# EAGLE design mainboard (EAGLE 6.5.0)
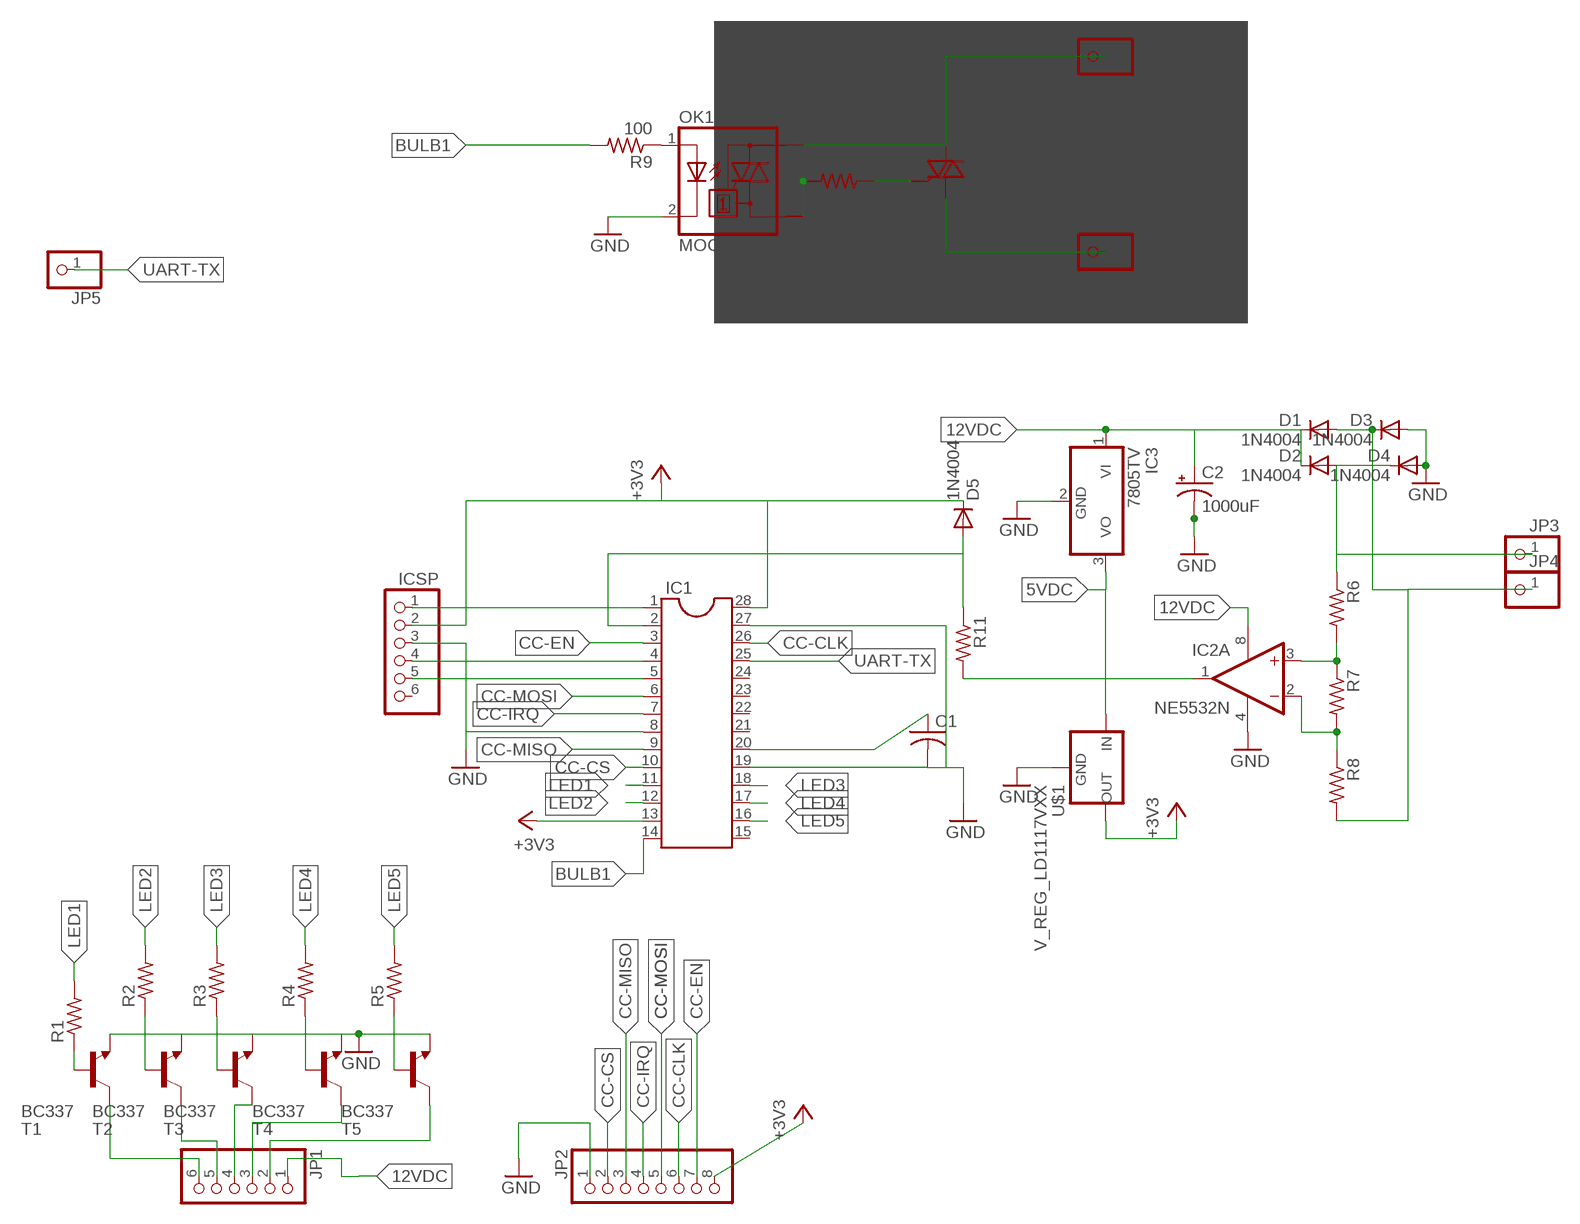
[diagram p0: schematic, sheet 1]

## Parts
230VAC1  PINHD-1X1CB  [1X01-CLEANBIG]
230VAC2  PINHD-1X1CB  [1X01-CLEANBIG]
BTB16  BT138-V  [TO220BV]
C1  C-US025-024X044  [C025-024X044]
C2  1000uF  CPOL-USB45181B  [B45181B]
D1  1N4004  [DO41-10]
D2  1N4004  [DO41-10]
D3  1N4004  [DO41-10]
D4  1N4004  [DO41-10]
D5  1N4004  [DO41-10]
IC1  DIL28-3  [DIL28-3]
IC2  NE5532N  [DIL08]
IC3  7805TV  [TO220V]
ICSP  PINHD-1X6  [1X06]
JP1  PINHD-1X6  [1X06]
JP2  PINHD-1X8BIG  [1X08-BIG]
JP3  PINHD-1X1CB  [1X01-CLEANBIG]
JP4  PINHD-1X1CB  [1X01-CLEANBIG]
JP5  PINHD-1X1  [1X01]
OK1  MOC3020M  [DIL06]
R1  R-US_0204/7  [0204/7]
R2  R-US_0204/7  [0204/7]
R3  R-US_0204/7  [0204/7]
R4  R-US_0204/7  [0204/7]
R5  R-US_0204/7  [0204/7]
R6  R-US_0207/10  [0207/10]
R7  R-US_0204/2V  [0204V]
R8  R-US_0207/10  [0207/10]
R9  100  R-US_0204/7  [0204/7]
R10  R-US_0204/7  [0204/7]
R11  R-US_0207/10  [0207/10]
T1  BC337  2N2222  [TO92-EBC-OVAL]
T2  BC337  2N2222  [TO92-EBC-OVAL]
T3  BC337  2N2222  [TO92-EBC-OVAL]
T4  BC337  2N2222  [TO92-EBC-OVAL]
T5  BC337  2N2222  [TO92-EBC-OVAL]
U$1  V_REG_LD1117VXX  [78XXL]

## Nets
5VDC: IC3.3(VO) U$1.OUT(IN)
12VDC: C2.+ D1.C D2.C IC2.8(P:V+) IC3.1(VI) JP1.1
+3V3: D5.C IC1.13 IC1.28 ICSP.2 JP2.8 U$1.GND(OUT)
BULB1: IC1.14 R9.2
CC-CLK: IC1.26 JP2.6
CC-CS: IC1.10 JP2.2
CC-EN: IC1.3 JP2.7
CC-IRQ: IC1.7 JP2.4
CC-MISO: IC1.9 JP2.3
CC-MOSI: IC1.6 JP2.5
GND: C1.2 C2.- D3.A D4.A IC1.8 IC1.19 IC1.27 IC2.4(P:V-) IC3.2(GND) ICSP.3 JP2.1 OK1.2(C) T1.E T5.E U$1.IN(GND)
LED1: IC1.11 R1.2
LED2: IC1.12 R2.2
LED3: IC1.18 R3.2
LED4: IC1.17 R4.2
LED5: IC1.16 R5.2
N$1: IC1.1 ICSP.1
N$2: D2.A D4.C JP3.1 R6.1
N$3: D1.A D3.C JP4.1 R8.2
N$4: IC1.4 ICSP.4
N$5: IC1.5 ICSP.5
N$7: JP1.6 T1.C
N$8: JP1.5 T2.C
N$9: JP1.4 T3.C
N$10: JP1.3 T4.C
N$11: JP1.2 T5.C
N$12: R1.1 T1.B
N$13: R2.1 T2.B
N$14: R3.1 T3.B
N$15: R4.1 T4.B
N$16: R5.1 T5.B
N$17: C1.1 IC1.20
N$28: IC2.3(A:+IN) R6.2 R7.1
N$29: IC2.2(A:-IN) R7.2 R8.1
N$30: D5.A IC1.2 R11.1
N$31: OK1.1(A) R9.1
N$32: OK1.4(A1) R10.2
N$33: 230VAC1.1 BTB16.T2(A2) OK1.6(A2)
N$34: 230VAC2.1 BTB16.T1(A1)
N$35: BTB16.G R10.1
N$37: IC2.1(A:OUT) R11.2
UART-TX: IC1.25 JP5.1
Unconnected: IC1.15 IC1.21 IC1.22 IC1.23 IC1.24 IC2.5(B:+IN) IC2.6(B:-IN) IC2.7(B:OUT) ICSP.6 T2.E T3.E T4.E

## Library data of the parts
230VAC1 230VAC2 JP3 JP4 = adafruit:PINHD-1X1: Pin header 1x1 for 0.1" spacing With round pins; OC_FARNELL: unknown
BTB16 = triac:BT138: TRIAC Source: http://www.semiconductors.philips.com BT138_SERIES_2.pdf; OC_FARNELL: unknown
C1 = adafruit:C-US: CAPACITOR, American symbol
C2 = adafruit:CPOL-US: POLARIZED CAPACITOR, American symbol; MF: RUBYCON; MPN: 25ZL1000MEFC12.5X20; OC_FARNELL: 1144703
D1-D5 = adafruit:1N4004: DIODE General purpose 1N400x type rectifier (With bigger pads) http://www.ladyada.net/library/pcb/eaglelibrary.html; MF: MULTICOMP; MPN: 1N4004; OC_FARNELL: 9565027
IC1 = ic-package:DIL28: Dual In Line
IC2 = linear:NE5532: AUDIO AMPLIFIER; MF: TEXAS INSTRUMENTS; MPN: NE5532AP; OC_FARNELL: 1106091
IC3 = linear:78*: Positive VOLTAGE REGULATOR Source: http://cache.national.com/ds/LM/LM78L05.pdf http://www.fairchildsemi.com/ds/LM/LM7805.pdf; OC_FARNELL: unknown
ICSP JP1 = adafruit:PINHD-1X6: PIN HEADER; OC_FARNELL: unknown
JP2 = adafruit:PINHD-1X8: PIN HEADER; OC_FARNELL: unknown
JP5 = adafruit:PINHD-1X1: Pin header 1x1 for 0.1" spacing With round pins
OK1 = optocoupler:MOC30*M: RANDOM-PHASE OPTOISOLATORS TRIAC DRIVER OUTPUT Source: http://www.fairchildsemi.com MOC3020-M.pdf; MF: FAIRCHILD SEMICONDUCTOR; MPN: MOC3020-M; OC_FARNELL: unknown; OC_NEWARK: 72K8895
R1-R6 R8-R11 = adafruit:R-US_: RESISTOR, American symbol; OC_FARNELL: unknown
R7 = adafruit:R-US_: RESISTOR, American symbol
T1-T5 = adafruit:2N2222: NPN TRANSISTOR Big oval pads; MF: FAIRCHILD SEMICONDUCTOR; MPN: BC33725TA; OC_FARNELL: 1695754
U$1 = sparkfun-poweric:V_REG_LD1117VXX: LD1117VXX voltage regulator. We carry the 3.3V version (COM-00526) in TO-220 package.; OC_FARNELL: unknown

## Board
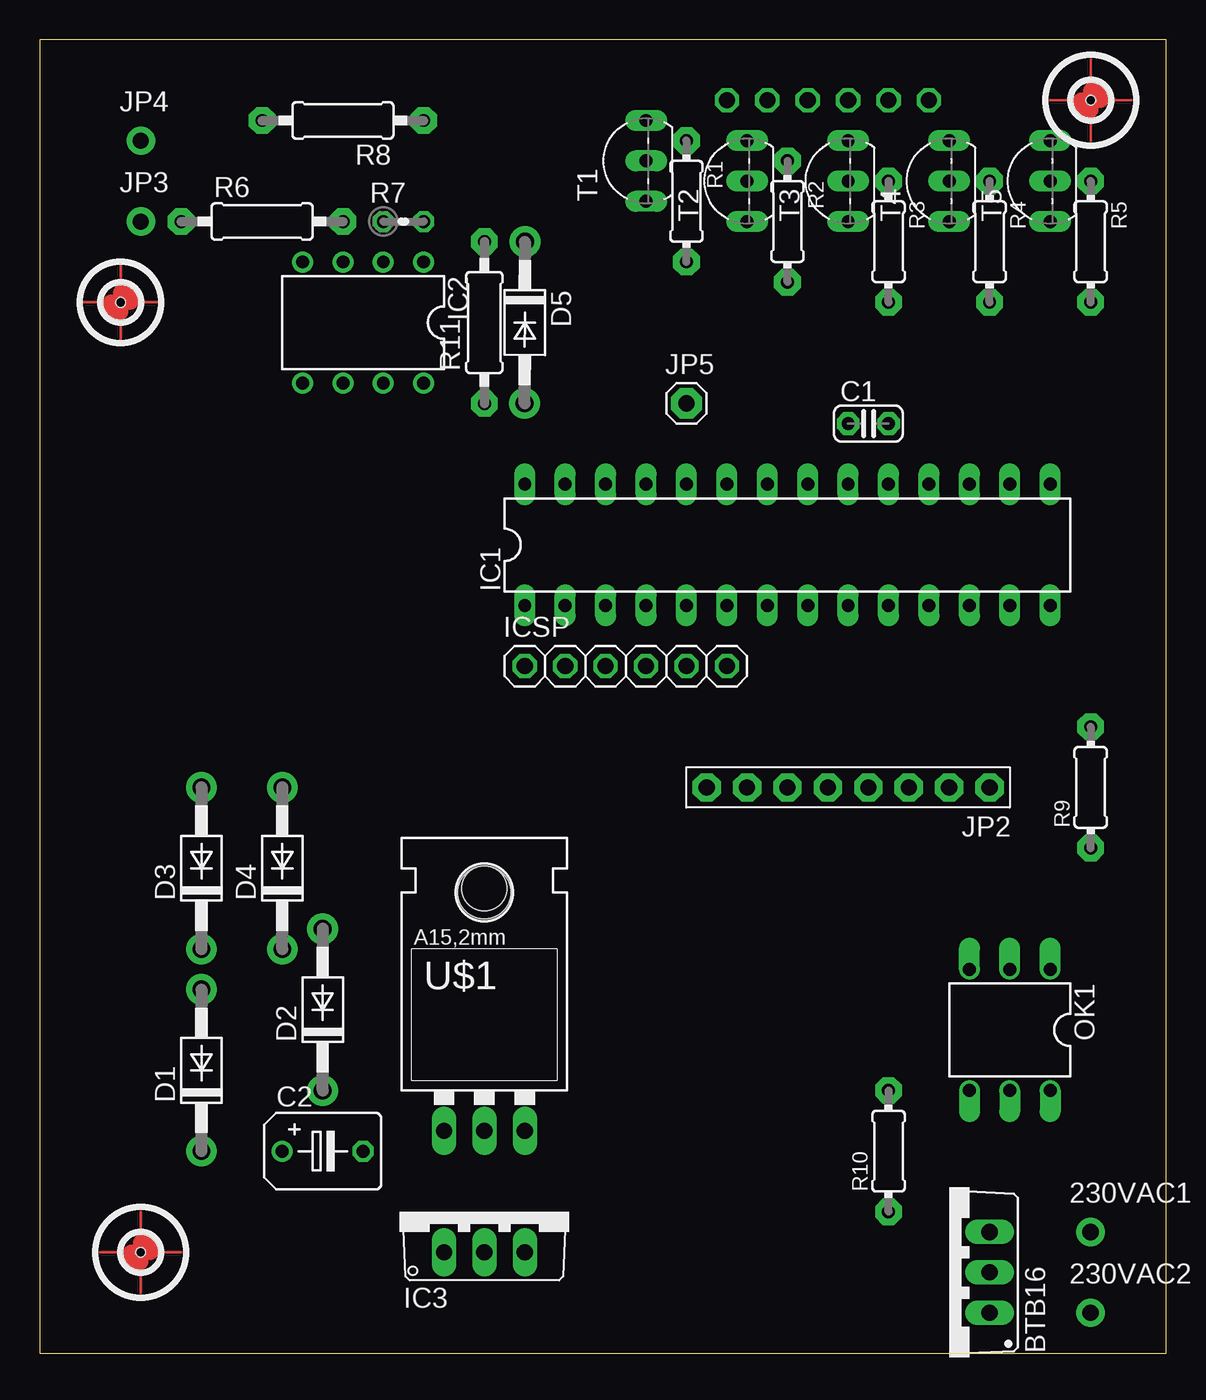
[diagram p1: board, top side]
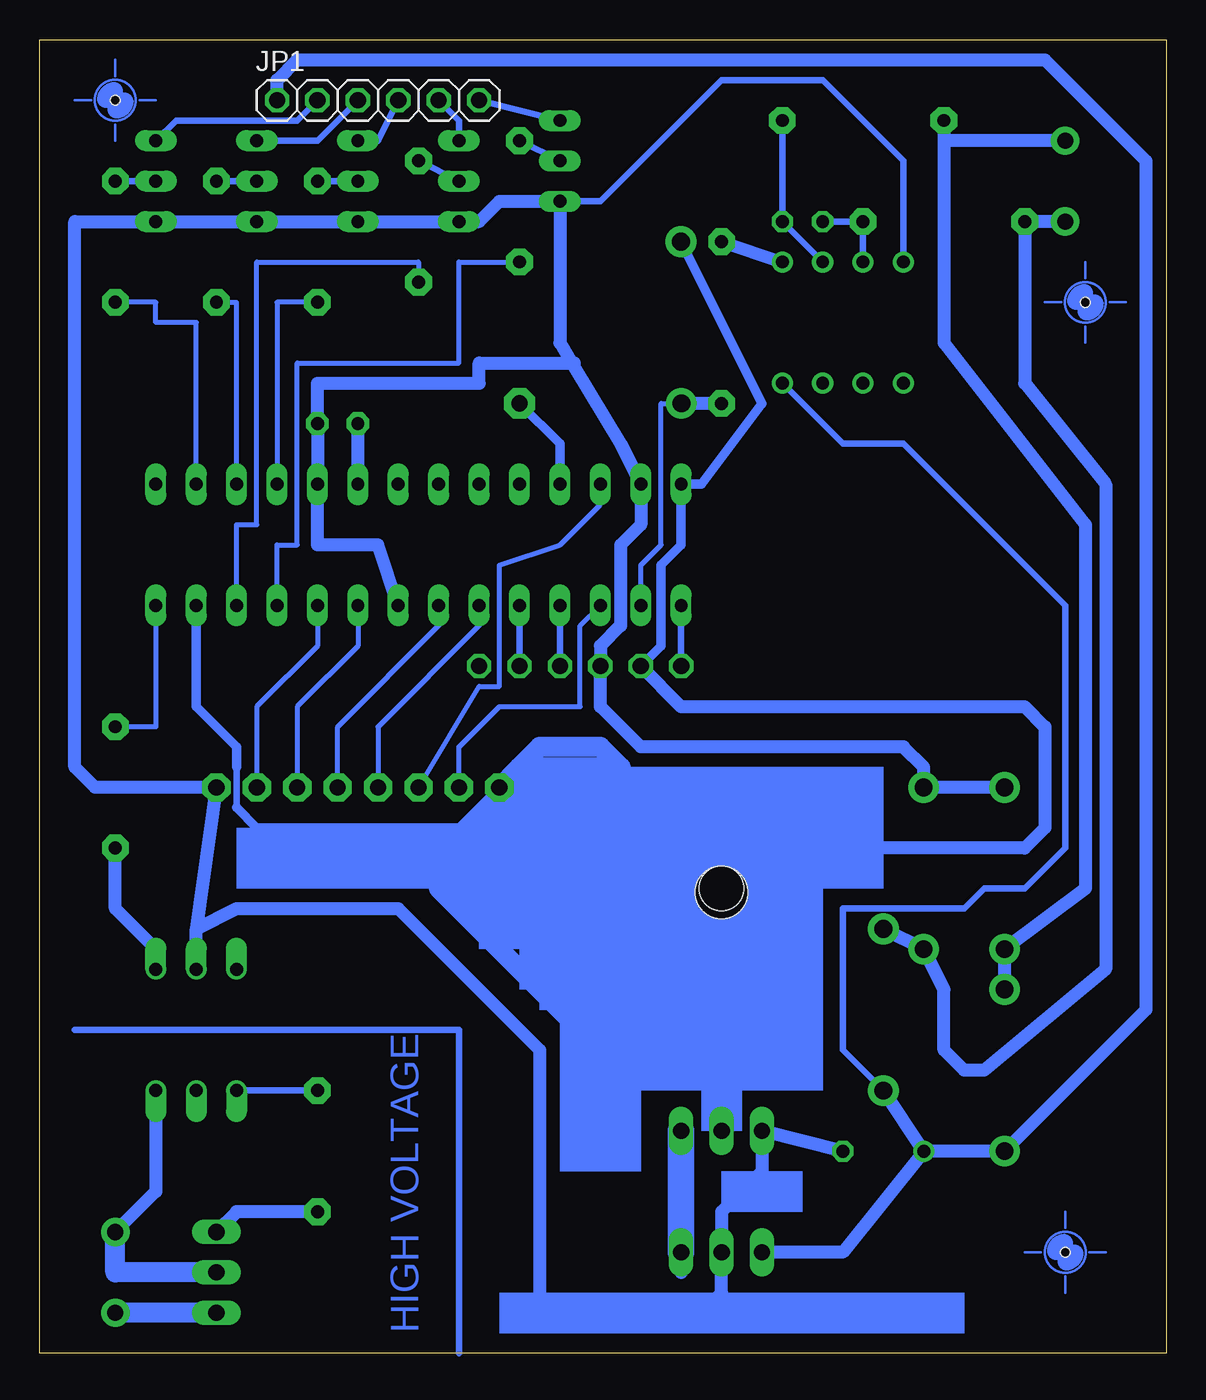
[diagram p2: board, bottom side, seen from below]

Size 70.79 x 82.54 mm. Coordinates in mm from the lower left corner, seen from the top.
Outline: 0,0 70.79,0 70.79,82.54 0,82.54 0,0
Copper layers (1*16): Top 0.035mm / dielectric 1.5mm / Bottom 0.035mm
Design rules "default": minimum track width 10mil, minimum drill 24mil, track to track 8mil, track to pad 8mil, pad to pad 8mil, via to via 8mil, smd to smd 8mil, copper to edge 40mil, drill to drill 8mil, minimum pad ring 10mil, minimum via ring 8mil, stop-mask expansion 4mil, vias tented up to drill 0mil, thermal gap 10mil
Holes 2.8 mm at 27.94,29.21
Holes 0.6 mm at 6.35,6.35 5.08,66.04 66.04,78.74

### Footprints (pad centres in the part's own frame; a part is rotated, then mirrored left to right if it is on the bottom)
1X01-CLEANBIG = drill 1.016 pad 1.778: 1 0,0
TO220BV = drill 1.016 long: G 2.54,-2.54; T1 -2.54,-2.54; T2 0,-2.54
C025-024X044 = drill 0.813 pad 1.422 octagon: 1 -1.27,0; 2 1.27,0
B45181B = drill 0.813: + -2.54,0 | drill 0.813 octagon: - 2.54,0
DO41-10 = drill 1.118 pad 1.93: A 5.08,0; C -5.08,0
DIL28-3 = drill 0.813 long: 1 -16.51,-3.81; 2 -13.97,-3.81; 3 -11.43,-3.81; 4 -8.89,-3.81; 5 -6.35,-3.81; 6 -3.81,-3.81; 7 -1.27,-3.81; 8 1.27,-3.81; 9 3.81,-3.81; 10 6.35,-3.81; 11 8.89,-3.81; 12 11.43,-3.81; 13 13.97,-3.81; 14 16.51,-3.81; 15 16.51,3.81; 16 13.97,3.81; 17 11.43,3.81; 18 8.89,3.81; 19 6.35,3.81; 20 3.81,3.81; 21 1.27,3.81; 22 -1.27,3.81; 23 -3.81,3.81; 24 -6.35,3.81; 25 -8.89,3.81; 26 -11.43,3.81; 27 -13.97,3.81; 28 -16.51,3.81
DIL08 = drill 0.813 pad 1.27: 1 -3.81,-3.81; 2 -1.27,-3.81; 3 1.27,-3.81; 4 3.81,-3.81; 5 3.81,3.81; 6 1.27,3.81; 7 -1.27,3.81; 8 -3.81,3.81
TO220V = drill 1.016 long: 1 -2.54,-2.54; 2 0,-2.54; 3 2.54,-2.54
1X06 = drill 1.016 octagon: 1 -6.35,0; 2 -3.81,0; 3 -1.27,0; 4 1.27,0; 5 3.81,0; 6 6.35,0
1X08-BIG = drill 1.016 pad 1.778 octagon: 1 -8.89,0; 2 -6.35,0; 3 -3.81,0; 4 -1.27,0; 5 1.27,0; 6 3.81,0; 7 6.35,0; 8 8.89,0
1X01 = drill 1.016 pad 1.93 octagon: 1 0,0
DIL06 = drill 0.813 offset: 1 -2.54,-3.81; 2 0,-3.81; 3 2.54,-3.81; 4 2.54,3.81; 5 0,3.81; 6 -2.54,3.81
0204/7 = drill 0.813 pad 1.676 octagon: 1 -3.81,0; 2 3.81,0
0207/10 = drill 0.813 pad 1.676 octagon: 1 -5.08,0; 2 5.08,0
0204V = drill 0.813 octagon: 1 -1.27,0; 2 1.27,0
TO92-EBC-OVAL = drill 0.813 long: B 0,-1.27; C 2.54,-1.27; E -2.54,-1.27
78XXL = drill 1.016 long: GND 0,-3.81; IN -2.54,-3.81; OUT 2.54,-3.81 | hole 3.302: 0,11.176

### Placement (x,y rotation side)
230VAC1  66.04,7.62 0 top
230VAC2  66.04,2.54 0 top
BTB16  57.15,5.08 90 top
C1  52.07,58.42 0 top
C2  17.78,12.7 0 top
D1  10.16,17.78 90 top
D2  17.78,21.59 90 top
D3  10.16,30.48 90 top
D4  15.24,30.48 90 top
D5  30.48,64.77 269.9 top
IC1  46.99,50.8 0 top
IC2  20.32,64.77 180 top
IC3  27.94,8.89 0 top
ICSP  36.83,43.18 0 top
JP1  49.53,78.74 0 bottom
JP2  50.8,35.56 180 top
JP3  6.35,71.12 0 top
JP4  6.35,76.2 0 top
JP5  40.64,59.69 0 top
OK1  60.96,20.32 180 top
R1  40.64,72.39 270 top
R2  46.99,71.12 270 top
R3  53.34,69.85 270 top
R4  59.69,69.85 270 top
R5  66.04,69.85 270 top
R6  13.97,71.12 0 top
R7  22.86,71.12 0 top
R8  19.05,77.47 180 top
R9  66.04,35.56 90 top
R10  53.34,12.7 90 top
R11  27.94,64.77 90 top
T1  36.83,74.93 90 top
T2  43.18,73.66 90 top
T3  49.53,73.66 90 top
T4  55.88,73.66 90 top
T5  62.23,73.66 90 top
U$1  27.94,17.78 0 top
U$3  [PASS-ROUND]  5.08,66.04 0 top
U$4  [PASS-ROUND]  6.35,6.35 0 top
U$5  [PASS-ROUND]  66.04,78.74 0 top

### Tracks (layer width: path | path; a pad name or v marks a point on that pad's centre or on a via)
5VDC
  Bottom 0.813: IC3.3 30.48,5.08
  Bottom 1.676: IC3.3 U$1.OUT
12VDC
  Bottom 0.406: IC2.8 20.32,57.15 16.51,57.15 6.35,46.99 6.35,31.75 8.89,29.21 11.43,29.21 12.7,27.94 20.32,27.94 20.32,19.05 D2.C
  Bottom 0.813: C2.+ 20.32,6.35 IC3.1 | C2.+ D1.C 1.27,21.59 1.27,74.93 7.62,81.28 54.61,81.28 55.88,80.01 JP1.1 | C2.+ D2.C
+3V3
  Bottom 0.406: 58.42,36.83 58.42,34.29
  Bottom 0.61: ICSP.2 31.75,44.45 31.75,49.53 30.48,50.8 IC1.28 29.21,54.61 25.4,59.69 D5.C | IC1.13 60.96,40.64 58.42,38.1 58.42,36.83 | 58.42,34.29 57.15,33.02 44.45,33.02 JP2.8
  Bottom 0.813: 34.29,35.56 29.21,35.56 27.94,34.29 27.94,31.75 | 27.94,31.75 U$1.GND | ICSP.2 30.48,40.64 8.89,40.64 7.62,39.37 7.62,33.02 8.89,31.75 27.94,31.75
  Bottom 1.27: 34.29,35.56 JP2.8 40.64,36.83 | 40.64,36.83 34.29,36.83 35.56,38.1 39.37,38.1 40.64,36.83
BULB1
  Bottom 0.305: IC1.14 63.5,39.37 R9.2
CC-CLK
  Bottom 0.305: JP2.6 43.18,41.91 41.91,41.91 41.91,49.53 38.1,50.8 35.56,53.34 IC1.26
CC-CS
  Bottom 0.305: IC1.10 53.34,44.45 57.15,40.64 JP2.2
CC-EN
  Bottom 0.305: JP2.7 44.45,38.1 41.91,40.64 36.83,40.64 36.83,45.72 IC1.3
CC-IRQ
  Bottom 0.305: JP2.4 52.07,39.37 45.72,45.72 IC1.7
CC-MISO
  Bottom 0.305: IC1.9 50.8,44.45 54.61,40.64 JP2.3
CC-MOSI
  Bottom 0.305: IC1.6 43.18,45.72 49.53,39.37 JP2.5
GND
  Bottom 0.406: IC2.4 16.51,74.93 21.59,80.01 27.94,80.01 35.56,72.39 T1.E | 53.34,50.8 C1.2
  Bottom 0.813: C2.- U$1.IN 25.4,11.43 27.94,8.89 IC3.2 27.94,3.81 29.21,2.54 39.37,2.54 39.37,19.05 48.26,27.94 58.42,27.94 60.96,26.67 | D3.A D4.A 15.24,36.83 16.51,38.1 33.02,38.1 35.56,40.64 ICSP.3 35.56,44.45 34.29,45.72 34.29,50.8 33.02,52.07 IC1.27 34.29,57.15 37.2,62.01 | 60.96,26.67 JP2.1 67.31,35.56 68.58,36.83 68.58,71.12 T5.E 43.18,71.12 41.91,72.39 T1.E 38.1,63.5 37.2,62.01 | OK1.2 60.96,26.67 | IC1.8 49.53,50.8 53.34,50.8 IC1.19 C1.2 53.34,60.96 43.18,60.96 43.18,62.23 37.2,62.23 37.2,62.01
LED1
  Bottom 0.305: IC1.11 55.88,50.8 54.61,50.8 54.61,62.23 44.45,62.23 44.45,68.58 R1.2
LED2
  Bottom 0.305: IC1.12 58.42,52.07 57.15,52.07 57.15,68.58 46.99,68.58 R2.2
LED3
  Bottom 0.305: R3.2 55.88,66.04 IC1.18
LED4
  Bottom 0.305: IC1.17 58.42,66.04 R4.2
LED5
  Bottom 0.305: IC1.16 60.96,64.77 63.5,64.77 63.5,66.04 R5.2
N$1
  Bottom 0.406: ICSP.1 IC1.1
N$2
  Bottom 0.813: JP3.1 R6.1 8.89,60.96 3.81,54.61 3.81,24.13 11.43,17.78 12.7,17.78 13.97,19.05 13.97,22.86 D4.C D2.A
N$3
  Bottom 0.813: D1.A D3.C 5.08,29.21 5.08,52.07 13.97,63.5 13.97,76.2 | R8.2 13.97,76.2 | JP4.1 13.97,76.2
N$4
  Bottom 0.406: IC1.4 ICSP.4
N$5
  Bottom 0.406: IC1.5 ICSP.5
N$6
  pour Bottom: 34.29,35.56 41.91,35.56 46.99,30.48 36.83,20.32 36.83,16.51 34.29,16.51
N$7
  Bottom 0.406: T1.C JP1.6
N$8
  Bottom 0.406: T2.C 44.45,77.47 JP1.5
N$9
  Bottom 0.406: T3.C 49.53,76.2 JP1.4
N$10
  Bottom 0.406: JP1.3 53.34,76.2 T4.C
N$11
  Bottom 0.406: JP1.2 54.61,77.47 62.23,77.47 T5.C
N$12
  Bottom 0.406: T1.B R1.1
N$13
  Bottom 0.406: T2.B R2.1
N$14
  Bottom 0.406: T3.B R3.1
N$15
  Bottom 0.406: T4.B R4.1
N$16
  Bottom 0.406: T5.B R5.1
N$17
  Bottom 0.813: IC1.20 C1.1
N$18
  pour Bottom (no thermals): 35.56,35.56 41.91,35.56 46.99,30.48 36.83,20.32 36.83,16.51 35.56,15.24 34.29,15.24 31.75,17.78 30.48,17.78 30.48,35.56
N$19
  Bottom 1.27: 41.91,34.29 43.18,33.02 | 44.45,31.75 43.18,33.02 | 43.18,33.02 40.64,33.02
N$20
  Bottom 1.27: 45.72,29.21 43.18,26.67 | 36.83,20.32 43.18,26.67 | 43.18,26.67 43.18,27.94 | 43.18,27.94 43.18,29.21 44.45,29.21 43.18,27.94
N$27
  Bottom 0.406: 68.58,20.32 44.45,20.32 44.45,0
N$28
  Bottom 0.406: IC2.3 R6.2 R7.1
N$29
  Bottom 0.406: R8.1 R7.2 IC2.2
N$30
  Bottom 0.305: IC1.2 33.02,49.53 31.75,50.8 31.75,59.69 | 31.75,59.69 | 31.75,59.69 D5.A
  Bottom 0.813: R11.1 | R11.1 D5.A
N$31
  Bottom 0.813: OK1.1 63.5,25.4 66.04,27.94 R9.1
N$32
  Bottom 0.406: R10.2 OK1.4
N$33
  Bottom 0.813: OK1.6 63.5,10.16 230VAC1.1
  Bottom 1.27: BTB16.T2 66.04,5.08 230VAC1.1
N$34
  Bottom 1.27: BTB16.T1 230VAC2.1
N$35
  Bottom 0.813: R10.1 58.42,8.89 BTB16.G
N$37
  Bottom 0.813: R11.2 IC2.1
UART-TX
  Bottom 0.61: JP5.1 38.1,57.15 IC1.25
(copper drawn outside any net)
  shapes: Bottom area x16

### Text on the board
Bottom: HIGH VOLTAGE
tSilk: HIGH VOLTAGE